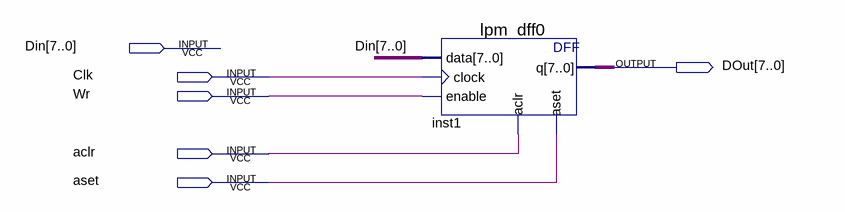
[diagram p0: schematic sheet]
// Quartus schematic d.bdf as structural Verilog: 1 symbols, 6 pins
module d (
  input  [7:0] Din,
  input  Clk,
  input  Wr,
  input  aclr,
  input  aset,
  output [7:0] DOut
);

  lpm_dff0 inst1 (.data(Din), .clock(Clk), .enable(Wr), .aclr(aclr), .aset(aset), .q(DOut));
endmodule
